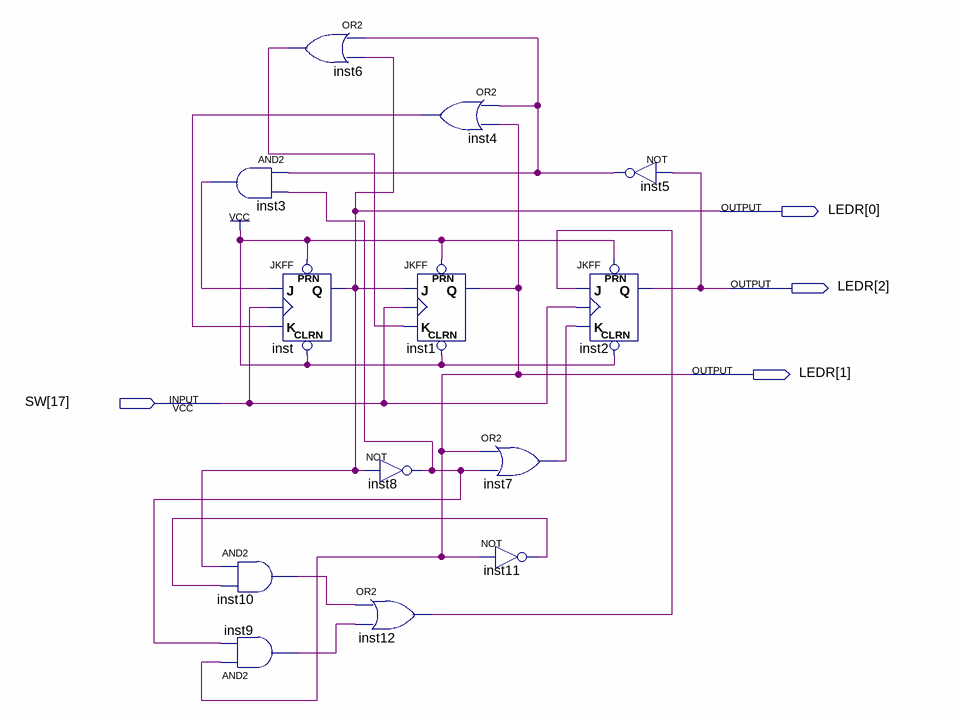
[diagram p0: schematic sheet]
// Quartus schematic ContadorSincronoP3.bdf as structural Verilog: 13 symbols, 4 pins
module ContadorSincronoP3 (
  input  [17:17] SW,
  output [2:0] LEDR
);

  wire inst3_out, inst4_out, inst5_out, inst6_out, inst7_out, inst8_out, inst9_out, inst10_out, inst11_out,
       inst12_out;

  and inst3 (inst3_out, inst5_out, inst8_out);
  and inst10 (inst10_out, LEDR[0], inst11_out);
  and inst9 (inst9_out, LEDR[1], inst8_out);
  or inst6 (inst6_out, inst5_out, LEDR[0]);
  JKFF inst (.PRN(1'b1), .CLRN(1'b1), .K(inst4_out), .J(inst3_out), .CLK(SW[17]), .Q(LEDR[0]));
  not inst8 (inst8_out, LEDR[0]);
  or inst12 (inst12_out, inst10_out, inst9_out);
  or inst4 (inst4_out, inst5_out, LEDR[1]);
  JKFF inst1 (.PRN(1'b1), .CLRN(1'b1), .K(inst6_out), .J(LEDR[0]), .CLK(SW[17]), .Q(LEDR[1]));
  or inst7 (inst7_out, LEDR[1], inst8_out);
  not inst11 (inst11_out, LEDR[1]);
  not inst5 (inst5_out, LEDR[2]);
  JKFF inst2 (.PRN(1'b1), .CLRN(1'b1), .K(inst7_out), .J(inst12_out), .CLK(SW[17]), .Q(LEDR[2]));
endmodule
